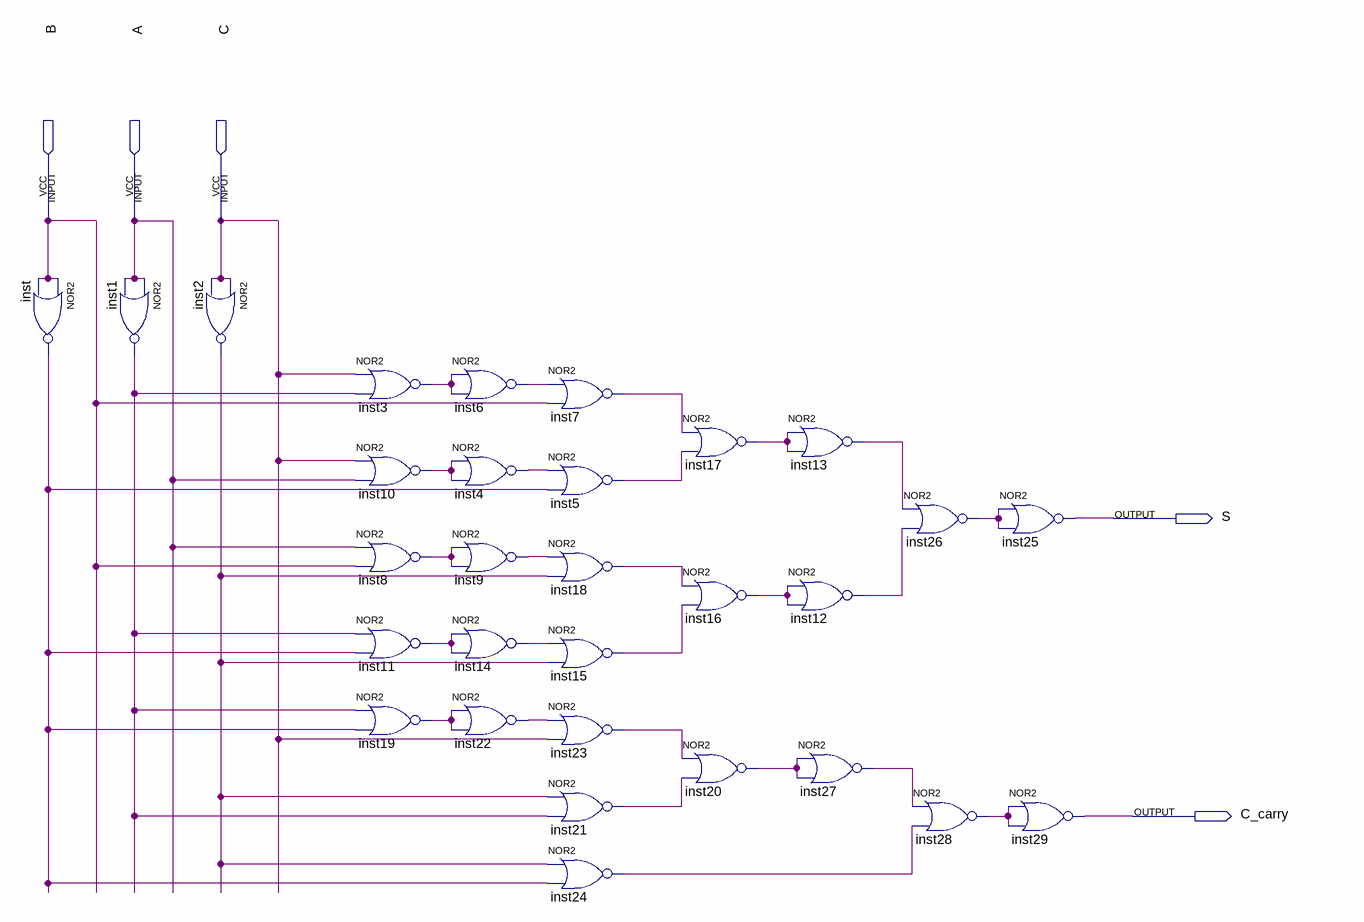
[diagram p0: schematic sheet]
// Quartus schematic CNT_2nor.bdf as structural Verilog: 30 symbols, 5 pins
module CNT_2nor (
  input  B,
  input  A,
  input  C,
  output S,
  output C_carry
);

  wire inst1_out, inst2_out, inst3_out, inst4_out, inst5_out, inst6_out, inst7_out, inst8_out, inst9_out,
       inst10_out, inst11_out, inst12_out, inst13_out, inst14_out, inst15_out, inst16_out, inst17_out,
       inst18_out, inst19_out, inst20_out, inst21_out, inst22_out, inst23_out, inst24_out, inst26_out,
       inst27_out, inst28_out, inst_out;

  nor inst (inst_out, B, B);
  nor inst1 (inst1_out, A, A);
  nor inst2 (inst2_out, C, C);
  nor inst3 (inst3_out, C, inst1_out);
  nor inst10 (inst10_out, C, A);
  nor inst8 (inst8_out, A, B);
  nor inst11 (inst11_out, inst1_out, inst_out);
  nor inst19 (inst19_out, inst1_out, inst_out);
  nor inst6 (inst6_out, inst3_out, inst3_out);
  nor inst4 (inst4_out, inst10_out, inst10_out);
  nor inst9 (inst9_out, inst8_out, inst8_out);
  nor inst14 (inst14_out, inst11_out, inst11_out);
  nor inst22 (inst22_out, inst19_out, inst19_out);
  nor inst7 (inst7_out, inst6_out, B);
  nor inst5 (inst5_out, inst4_out, inst_out);
  nor inst18 (inst18_out, inst9_out, inst2_out);
  nor inst15 (inst15_out, inst14_out, inst2_out);
  nor inst23 (inst23_out, inst22_out, C);
  nor inst21 (inst21_out, inst2_out, inst1_out);
  nor inst24 (inst24_out, inst2_out, inst_out);
  nor inst17 (inst17_out, inst7_out, inst5_out);
  nor inst16 (inst16_out, inst18_out, inst15_out);
  nor inst20 (inst20_out, inst23_out, inst21_out);
  nor inst13 (inst13_out, inst17_out, inst17_out);
  nor inst12 (inst12_out, inst16_out, inst16_out);
  nor inst27 (inst27_out, inst20_out, inst20_out);
  nor inst26 (inst26_out, inst13_out, inst12_out);
  nor inst28 (inst28_out, inst27_out, inst24_out);
  nor inst25 (S, inst26_out, inst26_out);
  nor inst29 (C_carry, inst28_out, inst28_out);
endmodule
